# EAGLE design PlantowerSPS (EAGLE 9.5.2)
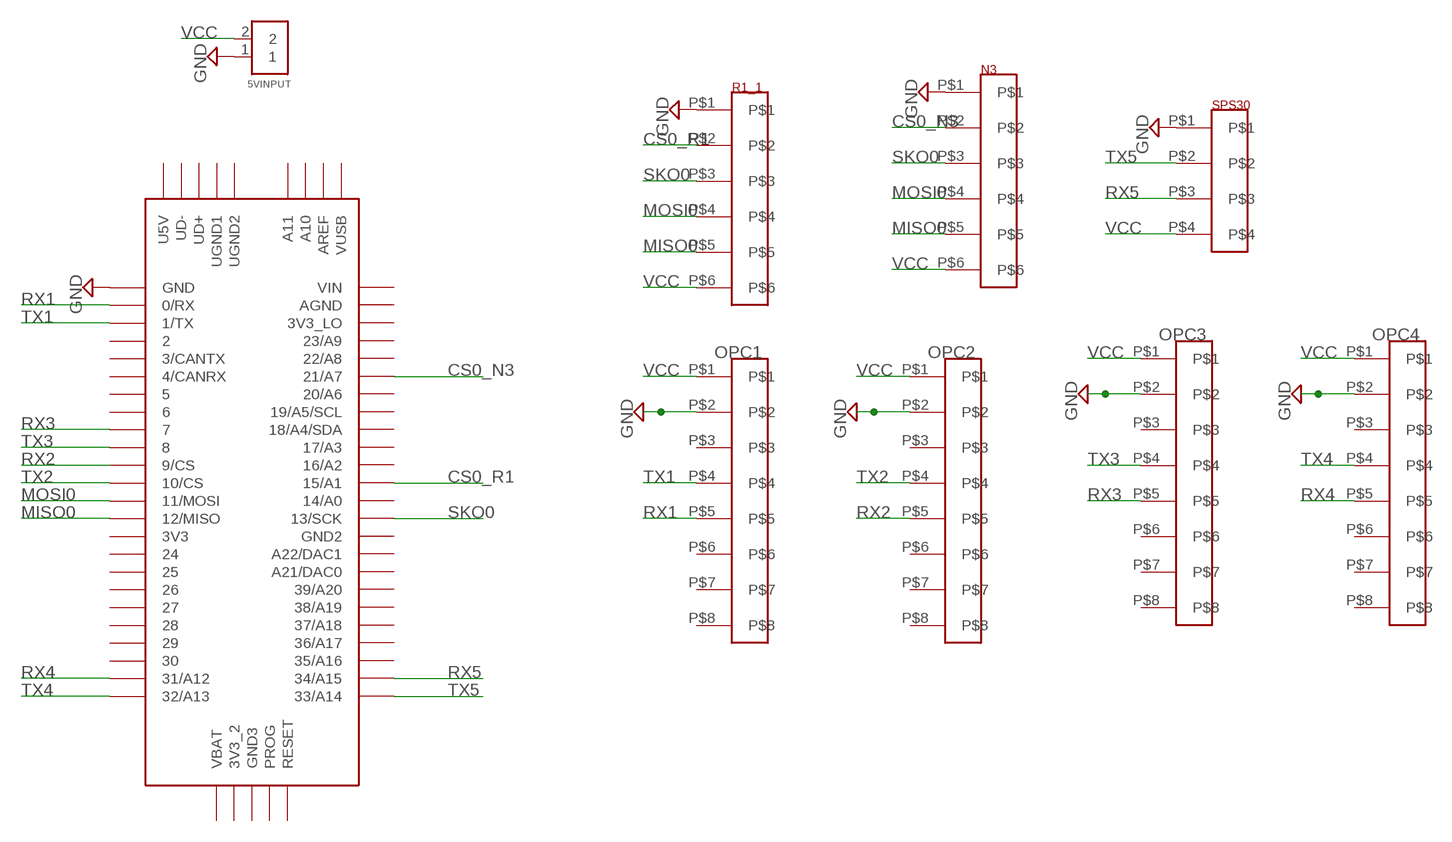
[diagram p0: schematic, sheet 1]

## Parts
5VINPUT  2PIN_TERMINAL_BLOCK  [2PIN_TERMINAL_BLOCK]
N3  6PINHEADER  [6PINHEADER]
OPC1  8PINHEADER  [8PINHEADER]
OPC2  8PINHEADER  [8PINHEADER]
OPC3  8PINHEADER  [8PINHEADER]
OPC4  8PINHEADER  [8PINHEADER]
R1_1  6PINHEADER  [6PINHEADER]
SPS30  4PINHEADER  [4PINHEADER]
U$1  TEENSY_3.5/3.6  [TEENSY_3.5/3.6]

## Nets
CS0_N3: N3.P$2 U$1.21/A7
CS0_R1: R1_1.P$2 U$1.15/A1
GND: 5VINPUT.1 N3.P$1 OPC1.P$2 OPC2.P$2 OPC3.P$2 OPC4.P$2 R1_1.P$1 SPS30.P$1 U$1.GND
MISO0: N3.P$5 R1_1.P$5 U$1.12/MISO
MOSI0: N3.P$4 R1_1.P$4 U$1.11/MOSI
RX1: OPC1.P$5 U$1.0/RX
RX2: OPC2.P$5 U$1.9/CS
RX3: OPC3.P$5 U$1.7
RX4: OPC4.P$5 U$1.31/A12
RX5: SPS30.P$3 U$1.34/A15
SKO0: N3.P$3 R1_1.P$3 U$1.13/SCK
TX1: OPC1.P$4 U$1.1/TX
TX2: OPC2.P$4 U$1.10/CS
TX3: OPC3.P$4 U$1.8
TX4: OPC4.P$4 U$1.32/A13
TX5: SPS30.P$2 U$1.33/A14
VCC: 5VINPUT.2 N3.P$6 OPC1.P$1 OPC2.P$1 OPC3.P$1 OPC4.P$1 R1_1.P$6 SPS30.P$4
Unconnected: OPC1.P$3 OPC1.P$6 OPC1.P$7 OPC1.P$8 OPC2.P$3 OPC2.P$6 OPC2.P$7 OPC2.P$8 OPC3.P$3 OPC3.P$6 OPC3.P$7 OPC3.P$8 OPC4.P$3 OPC4.P$6 OPC4.P$7 OPC4.P$8 U$1.2 U$1.3/CANTX U$1.3V3 U$1.3V3_2 U$1.3V3_LO U$1.4/CANRX U$1.5 U$1.6 U$1.14/A0 U$1.16/A2 U$1.17/A3 U$1.18/A4/SDA U$1.19/A5/SCL U$1.20/A6 U$1.21/DAC0(A21/DAC0) U$1.22/A8 U$1.23/A9 U$1.24 U$1.25 U$1.26 U$1.27 U$1.28 U$1.29 U$1.30 U$1.35/A16 U$1.36/A17 U$1.37/A18 U$1.38/A19 U$1.39/A20 U$1.A10 U$1.A11 U$1.A22/DAC1 U$1.AGND U$1.AREF U$1.GND2 U$1.GND3 U$1.PROG U$1.RESET U$1.U5V U$1.UD+ U$1.UD- U$1.UGND1 U$1.UGND2 U$1.VBAT U$1.VIN U$1.VUSB

## Library data of the parts
5VINPUT = Terminal_Block:2PIN_TERMINAL_BLOCK: Terminal block; 2.54mm; angled 90°; 0.03÷1mm2; ways: 2; 10A; H: 10mm; CENTERLINE_PITCH: 2.54 mm[.1 in]; COMMENT: 282834-2; DESCRIPTION: TERMI-BLOK PCB MOUNT, 90 2P.; DIGI-KEY_PART_NUMBER: A98333-ND; DIGI-KEY_PURCHASE_URL: https://www.digikey.com/product-detail/en/te-connectivity-amp-connectors/282834-2/A98333-ND/1150135?utm_source=snapeda&utm_medium=aggregator&utm_campaign=symbol; EU_ROHS_COMPLIANCE: Compliant with Exemptions; MF: TE Connectivity; MP: 282834-2; NUMBER_OF_POSITIONS: 2; PACKAGE: None; TE_PURCHASE_URL: https://www.te.com/usa-en/product-282834-2.html?te_bu=Cor&te_type=disp&te_campaign=seda_glo_cor-seda-global-disp-prtnr-fy19-seda-model-bom-cta_sma-317_1&elqCampaignId=32493
N3 R1_1 = 6pinheader:6PINHEADER: 6 Pin Header
OPC1-OPC4 = 8pinheader:8PINHEADER: 8 pin header
SPS30 = 4PinHeader:4PINHEADER: 4 Pin Header
U$1 = Teensy356:TEENSY_3.5/3.6: Teensy 3.5/3.6

## Board
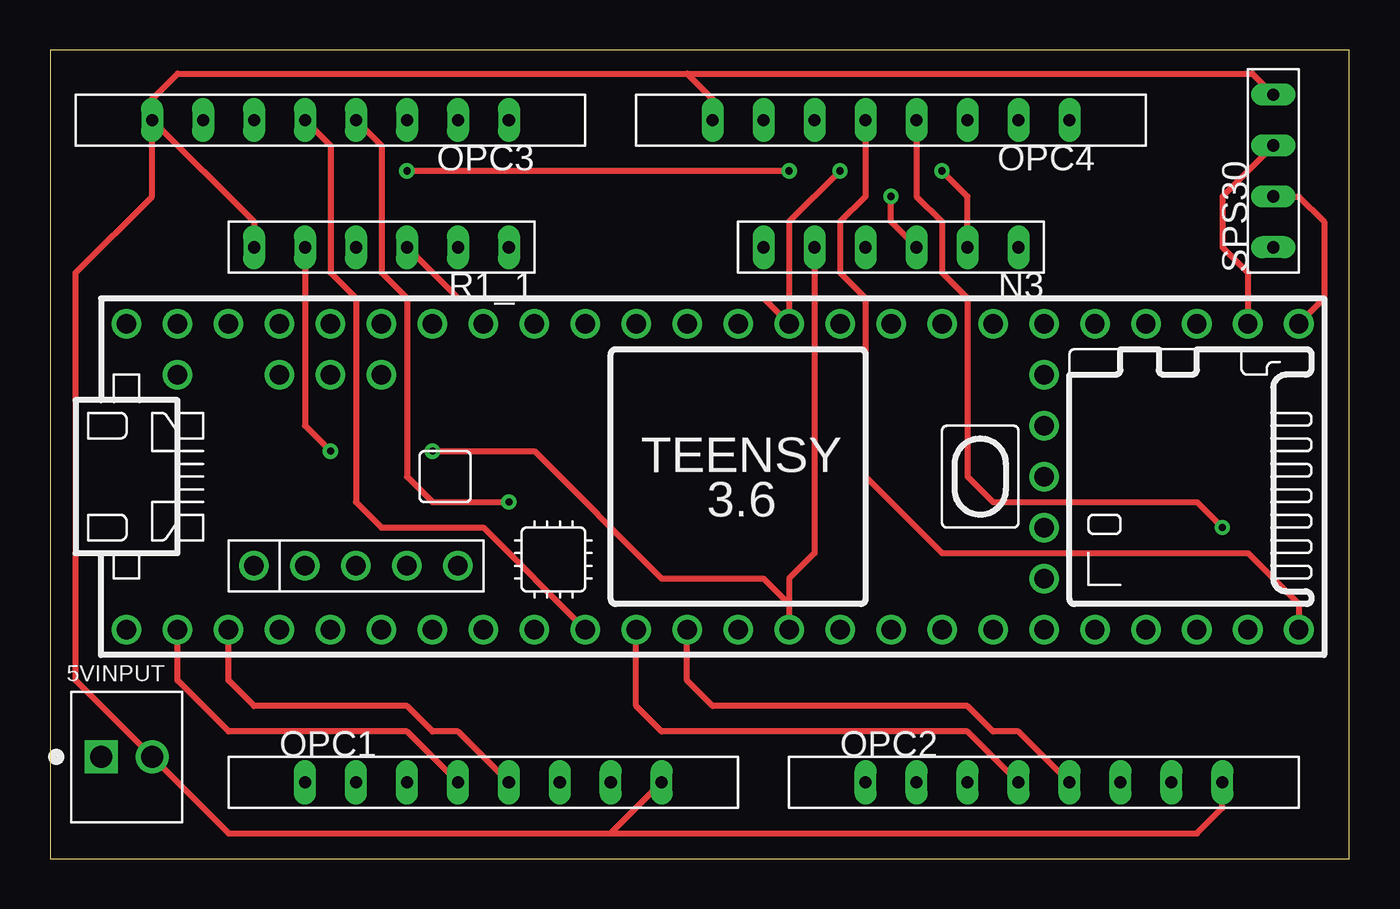
[diagram p1: board, top side]
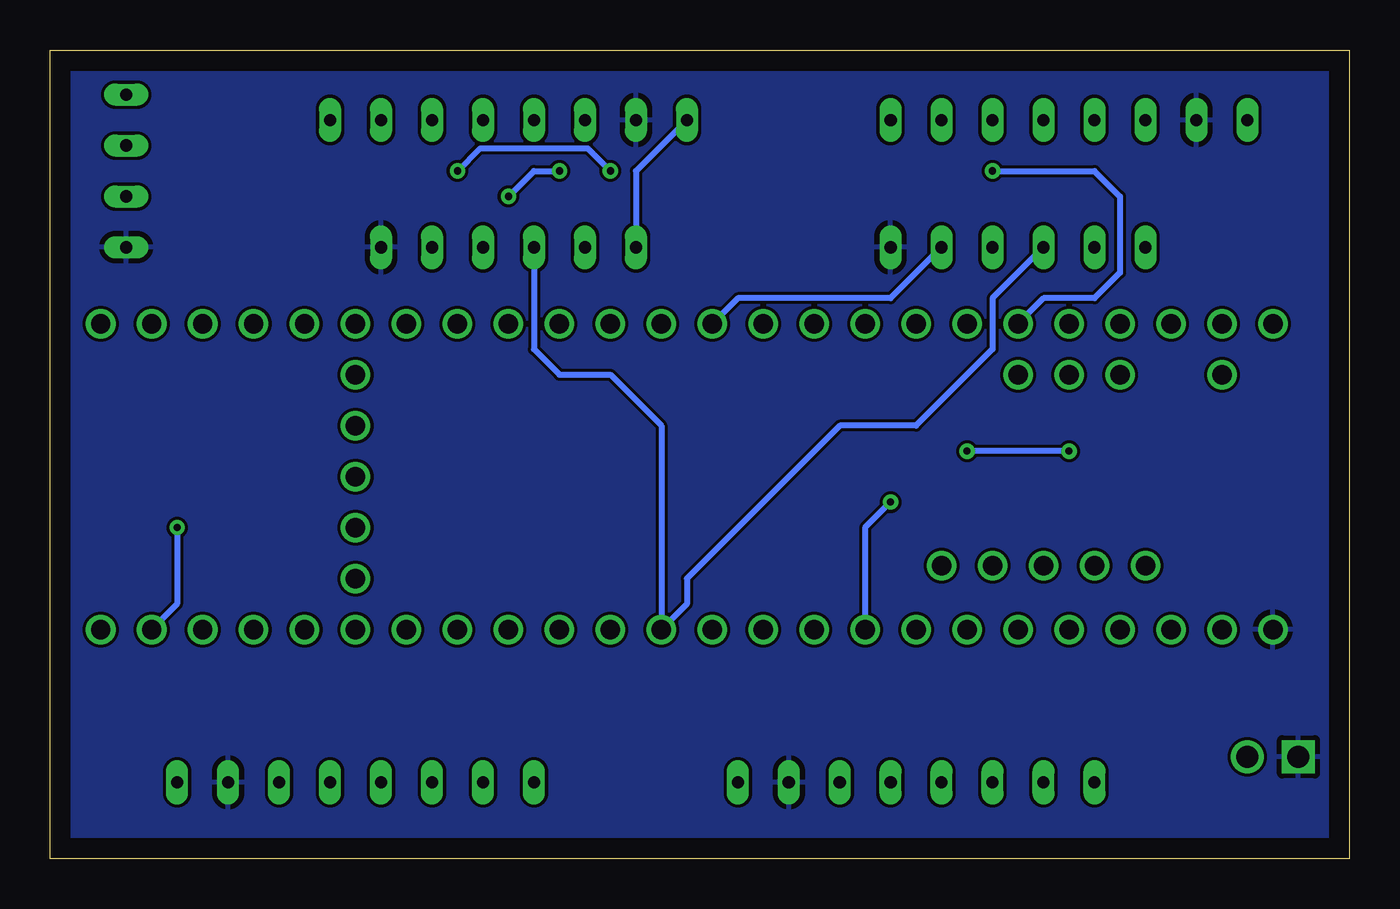
[diagram p2: board, bottom side, seen from below]

Size 64.75 x 40.31 mm. Coordinates in mm from the lower left corner, seen from the top.
Outline: 0,0 64.75,0 64.75,40.31 0,40.31 0,0
Copper layers (1*16): Top 0.035mm / dielectric 0.15mm / Bottom 0.035mm
Design rules "default": minimum track width 6mil, minimum drill 0.35mm, track to track 6mil, track to pad 6mil, pad to pad 6mil, via to via 6mil, smd to smd 6mil, copper to edge 40mil, drill to drill 6mil, minimum pad ring 10mil, minimum via ring 8mil, stop-mask expansion 4mil, vias tented up to drill 0mil, thermal gap 10mil

### Footprints (pad centres in the part's own frame; a part is rotated, then mirrored left to right if it is on the bottom)
2PIN_TERMINAL_BLOCK = drill 1.1 square: 1 -1.27,0 | drill 1.1: 2 1.27,0
6PINHEADER = drill 0.6 long: P$1 -6.35,0; P$2 -3.81,0; P$3 -1.27,0; P$4 1.27,0; P$5 3.81,0; P$6 6.35,0
8PINHEADER = drill 0.6 long: P$1 8.89,0; P$2 6.35,0; P$3 3.81,0; P$4 1.27,0; P$5 -1.27,0; P$6 -3.81,0; P$7 -6.35,0; P$8 -8.89,0
4PINHEADER = drill 0.6 long: P$1 -3.81,0; P$2 -1.27,0; P$3 1.27,0; P$4 3.81,0
TEENSY_3.5/3.6 = drill 0.965: 0/RX -25.4,-7.62; 1/TX -22.86,-7.62; 2 -20.32,-7.62; 3/CANTX -17.78,-7.62; 3V3 7.62,-7.62; 3V3_2 17.78,-2.54; 3V3_LO -22.86,7.62; 4/CANRX -15.24,-7.62; 5 -12.7,-7.62; 6 -10.16,-7.62; 7 -7.62,-7.62; 8 -5.08,-7.62; 9/CS -2.54,-7.62; 10/CS 0,-7.62; 11/MOSI 2.54,-7.62; 12/MISO 5.08,-7.62; 13/SCK 5.08,7.62; 14/A0 2.54,7.62; 15/A1 0,7.62; 16/A2 -2.54,7.62; 17/A3 -5.08,7.62; 18/A4/SDA -7.62,7.62; 19/A5/SCL -10.16,7.62; 20/A6 -12.7,7.62; 21/A7 -15.24,7.62; 21/DAC0 12.7,7.62; 22/A8 -17.78,7.62; 23/A9 -20.32,7.62; 24 10.16,-7.62; 25 12.7,-7.62; 26 15.24,-7.62; 27 17.78,-7.62; 28 20.32,-7.62; 29 22.86,-7.62; 30 25.4,-7.62; 31/A12 27.94,-7.62; 32/A13 30.48,-7.62; 33/A14 30.48,7.62; 34/A15 27.94,7.62; 35/A16 25.4,7.62; 36/A17 22.86,7.62; 37/A18 20.32,7.62; 38/A19 17.78,7.62; 39/A20 15.24,7.62; A10 -17.78,5.08; A11 -15.24,5.08; A22/DAC1 10.16,7.62; AGND -25.4,7.62; AREF -20.32,5.08; GND -27.94,-7.62; GND2 7.62,7.62; GND3 17.78,0; PROG 17.78,2.54; RESET 17.78,5.08; U5V -21.59,-4.445; UD+ -16.51,-4.445; UD- -19.05,-4.445; UGND1 -13.97,-4.445; UGND2 -11.43,-4.445; VBAT 17.78,-5.08; VIN -27.94,7.62; VUSB -25.4,5.08

### Placement (x,y rotation side)
5VINPUT  3.81,5.08 0 top
N3  41.91,30.48 180 top
OPC1  21.59,3.81 0 top
OPC2  49.53,3.81 0 top
OPC3  13.97,36.83 180 top
OPC4  41.91,36.83 180 top
R1_1  16.51,30.48 180 top
SPS30  60.96,34.29 90 top
U$1  31.75,19.05 0 top

### Tracks (layer width: path | path; a pad name or v marks a point on that pad's centre or on a via)
CS0_N3  (via drill 0.35)
  Top 0.305: N3.P$2 45.72,33.02 v44.45,34.29 | v36.83,34.29 v17.78,34.29
  Bottom 0.305: v44.45,34.29 43.32,35.42 37.96,35.42 v36.83,34.29 | v17.78,34.29 12.7,34.29 11.43,33.02 11.43,29.21 12.7,27.94 15.24,27.94 U$1.21/A7
CS0_R1
  Bottom 0.305: R1_1.P$2 22.86,27.94 30.48,27.94 U$1.15/A1
GND
  pour Bottom: -1.27,41.91 66.04,41.91 66.04,-1.27 -1.27,-1.27
MISO0  (via drill 0.35)
  Top 0.305: R1_1.P$5 12.7,21.59 v13.97,20.32 | v19.05,20.32 24.13,20.32 30.48,13.97 35.56,13.97 36.2,13.34 36.83,12.7 U$1.12/MISO 36.83,13.97 38.1,15.24 N3.P$5
  Bottom 0.305: v13.97,20.32 v19.05,20.32
MOSI0
  Bottom 0.305: R1_1.P$4 17.78,27.94 17.78,25.4 21.59,21.59 25.4,21.59 33.02,13.97 33.02,12.7 U$1.11/MOSI 34.29,21.59 36.83,24.13 39.37,24.13 40.64,25.4 N3.P$4
RX1
  Top 0.305: OPC1.P$5 17.78,6.35 8.89,6.35 6.35,8.89 U$1.0/RX
RX2
  Top 0.305: U$1.9/CS 29.21,7.62 30.48,6.35 45.72,6.35 OPC2.P$5
RX3  (via drill 0.35)
  Top 0.305: OPC3.P$5 16.51,35.56 16.51,29.21 17.78,27.94 17.78,19.05 19.05,17.78 v22.86,17.78
  Bottom 0.305: v22.86,17.78 24.13,16.51 U$1.7
RX4  (via drill 0.35)
  Top 0.305: OPC4.P$5 43.18,33.02 44.45,31.75 44.45,29.21 45.72,27.94 45.72,19.05 46.99,17.78 57.15,17.78 v58.42,16.51
  Bottom 0.305: U$1.31/A12 58.42,12.7 v58.42,16.51
RX5
  Top 0.305: U$1.34/A15 59.69,29.21 58.42,30.48 58.42,33.02 SPS30.P$3
SKO0  (via drill 0.35)
  Top 0.305: R1_1.P$3 20.32,27.94 35.56,27.94 U$1.13/SCK 36.83,31.75 v39.37,34.29 | N3.P$3 41.91,31.75 v41.91,33.02
  Bottom 0.305: v41.91,33.02 40.64,34.29 v39.37,34.29
TX1
  Top 0.305: U$1.1/TX 8.89,8.89 10.16,7.62 17.78,7.62 19.05,6.35 20.32,6.35 OPC1.P$4
TX2
  Top 0.305: U$1.10/CS 31.75,8.89 33.02,7.62 45.72,7.62 46.99,6.35 48.26,6.35 OPC2.P$4
TX3
  Top 0.305: OPC3.P$4 13.97,35.56 13.97,29.21 15.24,27.94 15.24,17.78 16.51,16.51 21.59,16.51 U$1.8
TX4
  Top 0.305: OPC4.P$4 40.64,33.02 39.37,31.75 39.37,29.21 40.64,27.94 40.64,19.05 44.45,15.24 59.69,15.24 62.23,12.7 U$1.32/A13
TX5
  Top 0.305: SPS30.P$2 62.23,33.02 63.5,31.75 63.5,27.94 U$1.33/A14
VCC
  Top 0.305: 27.94,1.27 8.89,1.27 5VINPUT.2 1.27,8.89 1.27,29.21 5.08,33.02 OPC3.P$1 | 27.94,1.27 OPC1.P$1 | 27.94,1.27 57.15,1.27 58.42,2.54 OPC2.P$1 | OPC3.P$1 5.08,37.87 6.35,39.14 31.75,39.14 | 31.75,39.14 33.02,37.87 OPC4.P$1 | 31.75,39.14 59.92,39.14 SPS30.P$4 | R1_1.P$6 10.16,31.75 OPC3.P$1
  Bottom 0.305: OPC4.P$1 35.56,34.29 N3.P$6